# EAGLE design SparkFun_AVR_Programming_Adapter_v12 (EAGLE 7.2.0)
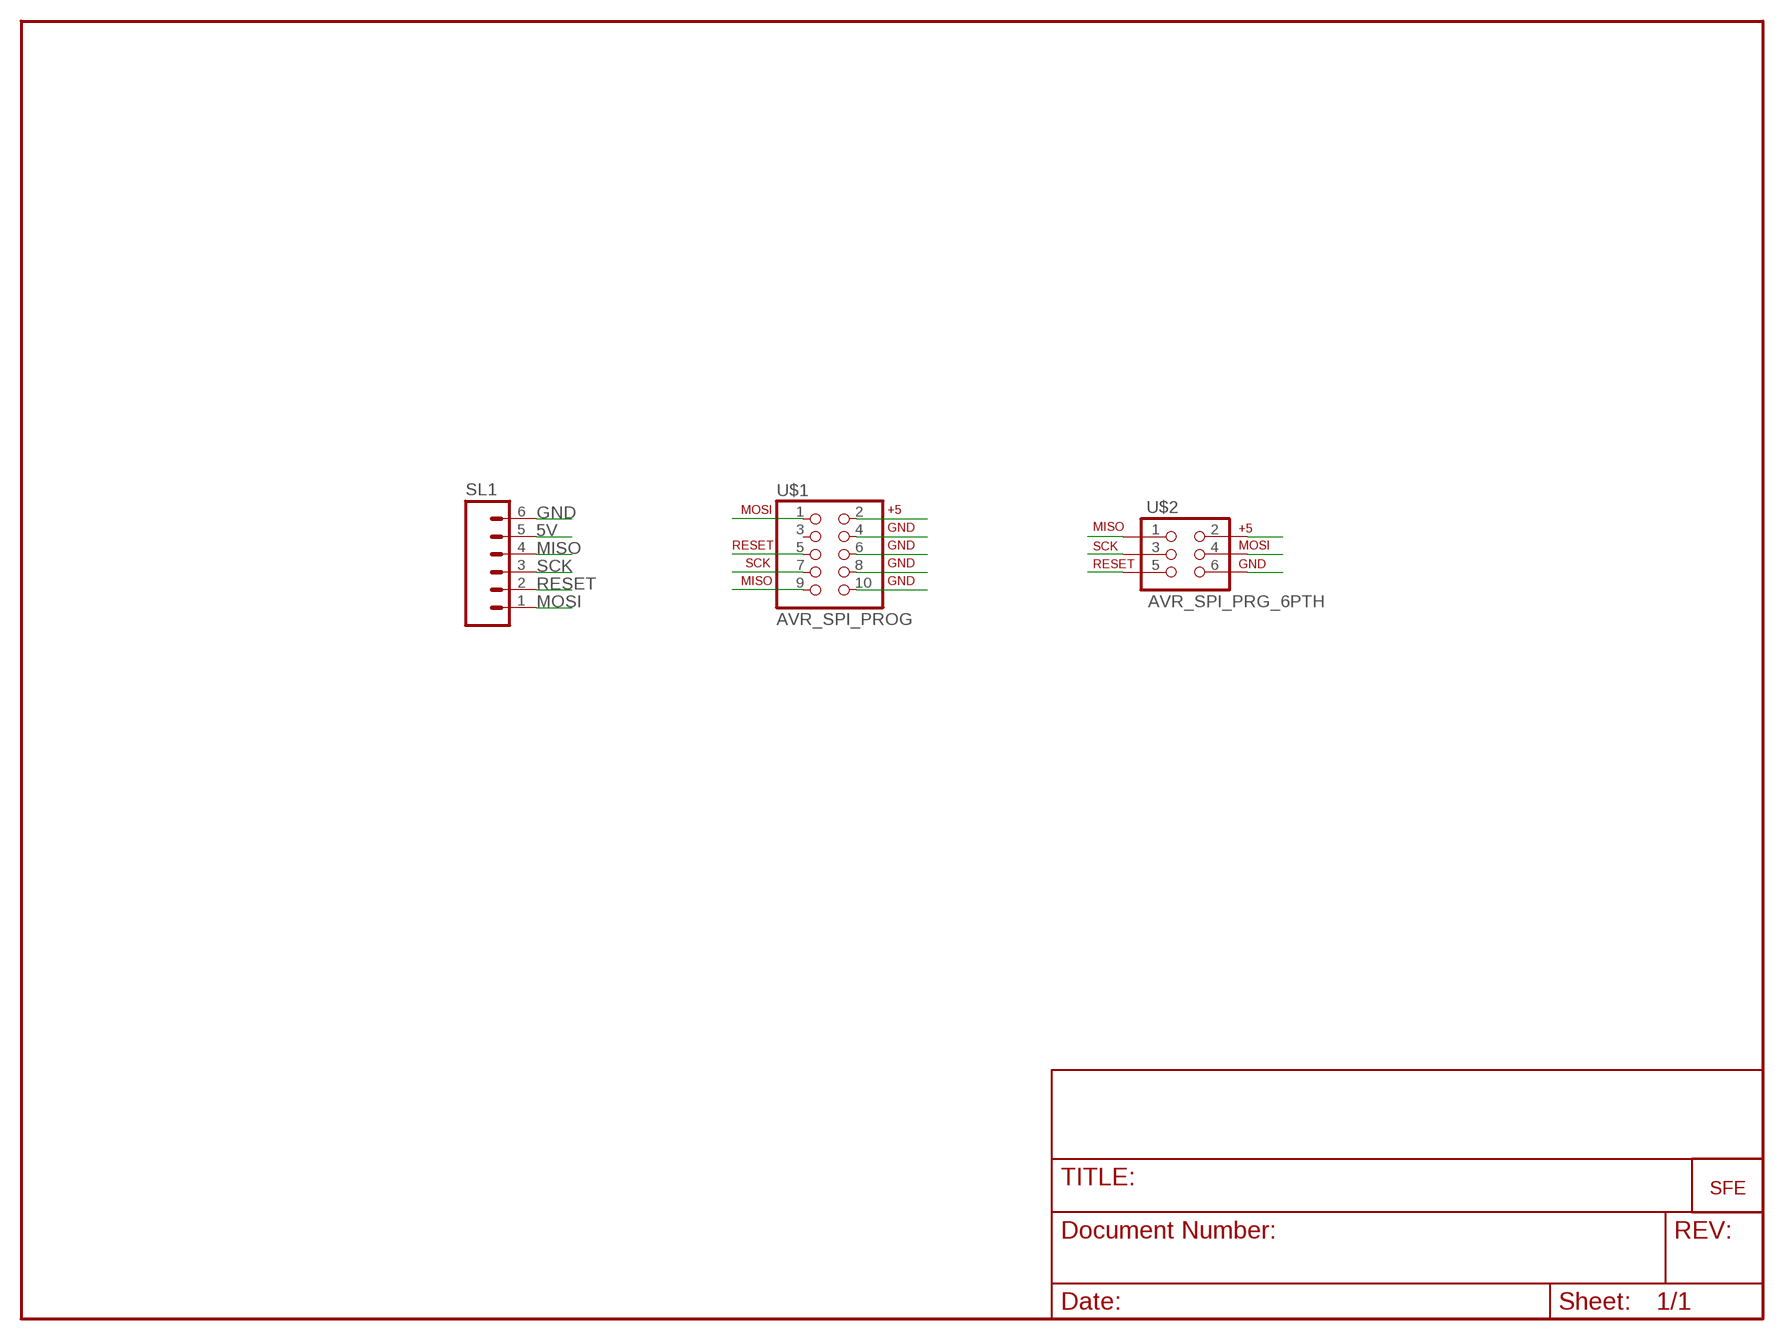
[diagram p0: schematic, sheet 1]

## Parts
SL1  M06SIP  [1X06]
U$1  AVR_SPI_PROG  [AVR_ICSP]
U$2  AVR_SPI_PRG_6PTH  [2X3]
U$3  LOGO-SFENEW  [SFE-NEW-WEBLOGO]

## Nets
5V: SL1.5 U$1.2 U$2.2
GND: SL1.6 U$1.4 U$1.6 U$1.8 U$1.10 U$2.6
MISO: SL1.4 U$1.9 U$2.1
MOSI: SL1.1 U$1.1 U$2.4
RESET: SL1.2 U$1.5 U$2.5
SCK: SL1.3 U$1.7 U$2.3
Unconnected: U$1.3

## Library data of the parts
SL1 = SparkFun:M06: Header 6 Standard 6-pin 0.1" header. Use with straight break away headers (SKU : PRT-00116), right angle break away headers (PRT-00553), swiss pins (PRT-00743), machine pins (PRT-00117), and female headers (PRT-00115). Molex polarized connector foot print use with SKU : PRT-08094 with associated crimp pins and housings.
U$1 = SparkFun:AVR_SPI_PROG: AVR ICSP Header This is the standard AVR In Circuit Serial Programming header. Minimal, but includes pin one indicator. Works with standard Olimex programmers. Also look for the 6-pin reduced version. Spark Fun Electronics SKU: PRT-00778
U$2 = SparkFun:AVR_SPI_PRG_6
U$3 = SparkFun:LOGO-SFE: Spark Fun Electronics PCB Logo This is the standard Spark Fun Electronics PCB logo.

## Board
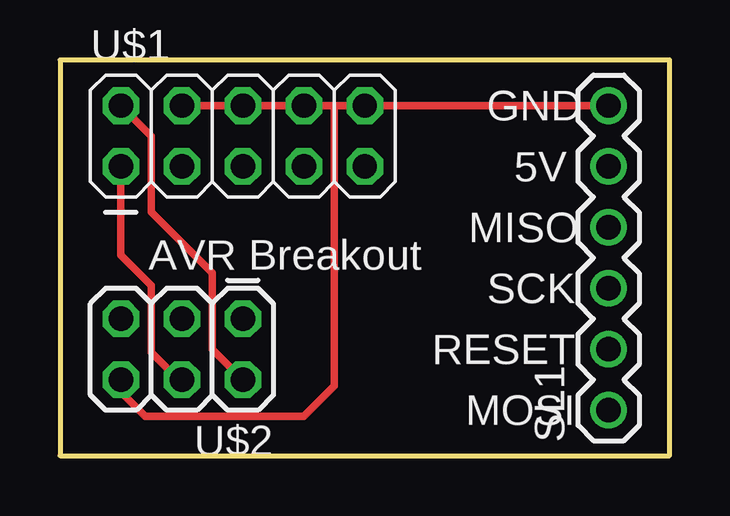
[diagram p1: board, top side]
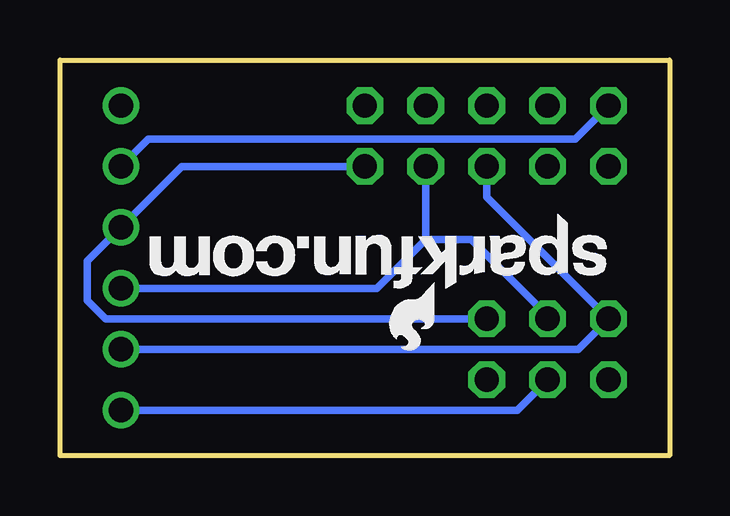
[diagram p2: board, bottom side, seen from below]

Size 25.4 x 16.51 mm. Coordinates in mm from the lower left corner, seen from the top.
Outline: 25.4,0 25.4,16.51 0,16.51 0,0 25.4,0
Copper layers (1*16): Top 0.035mm / dielectric 1.5mm / Bottom 0.035mm
Design rules "default": minimum track width 10mil, minimum drill 24mil, track to track 8mil, track to pad 8mil, pad to pad 8mil, via to via 8mil, smd to smd 8mil, copper to edge 40mil, drill to drill 8mil, minimum pad ring 10mil, minimum via ring 8mil, stop-mask expansion 4mil, vias tented up to drill 0mil, thermal gap 10mil

### Footprints (pad centres in the part's own frame; a part is rotated, then mirrored left to right if it is on the bottom)
1X06 = drill 1.016: 1 0,0; 2 2.54,0; 3 5.08,0; 4 7.62,0; 5 10.16,0; 6 12.7,0
AVR_ICSP = drill 1.016 octagon: 1 -1.27,5.08; 2 1.27,5.08; 3 -1.27,2.54; 4 1.27,2.54; 5 -1.27,0; 6 1.27,0; 7 -1.27,-2.54; 8 1.27,-2.54; 9 -1.27,-5.08; 10 1.27,-5.08
2X3 = drill 1.016 octagon: 1 0,0; 2 0,2.54; 3 2.54,0; 4 2.54,2.54; 5 5.08,0; 6 5.08,2.54

### Placement (x,y rotation side)
SL1  22.86,1.91 90 top
U$1  7.62,13.34 90 top
U$2  7.62,5.71 180 top
U$3  2.6,10.1 180 bottom

### Tracks (layer width: path | path; a pad name or v marks a point on that pad's centre or on a via)
5V
  Top 0.305: U$2.2 6.35,4.45 6.35,7.62 3.81,10.16 3.81,13.34 U$1.2
  Bottom 0.305: SL1.5 21.72,13.21 3.94,13.21 U$1.2
GND
  Top 0.305: U$1.4 U$1.6 U$1.8 11.43,14.61 | 11.43,14.61 U$1.10 SL1.6 | U$2.6 2.54,2.67 3.56,1.65 10.16,1.65 11.43,2.92 11.43,14.61
MISO
  Bottom 0.305: U$1.9 20.32,12.06 SL1.4 24.26,8.13 24.26,6.48 23.5,5.71 U$2.1
MOSI
  Top 0.305: U$1.1 2.54,8.38 3.81,7.11 3.81,4.32 5.08,3.05 U$2.4
  Bottom 0.305: SL1.1 6.35,1.91 U$2.4
RESET
  Bottom 0.305: U$1.5 7.62,10.79 U$2.5 3.81,4.45 SL1.2
SCK
  Bottom 0.305: 10.16,9.02 U$1.7 | 10.16,9.02 12.19,6.99 SL1.3 | U$2.3 5.08,5.84 8.26,9.02 10.16,9.02

### Text on the board
tPlace: GND | 5V | MISO | AVR Breakout | SCK | RESET | MOSI